# Altium schematic sheet Schematic.SchDoc
size A3; SheetNumber: 1; SheetTotal: 1
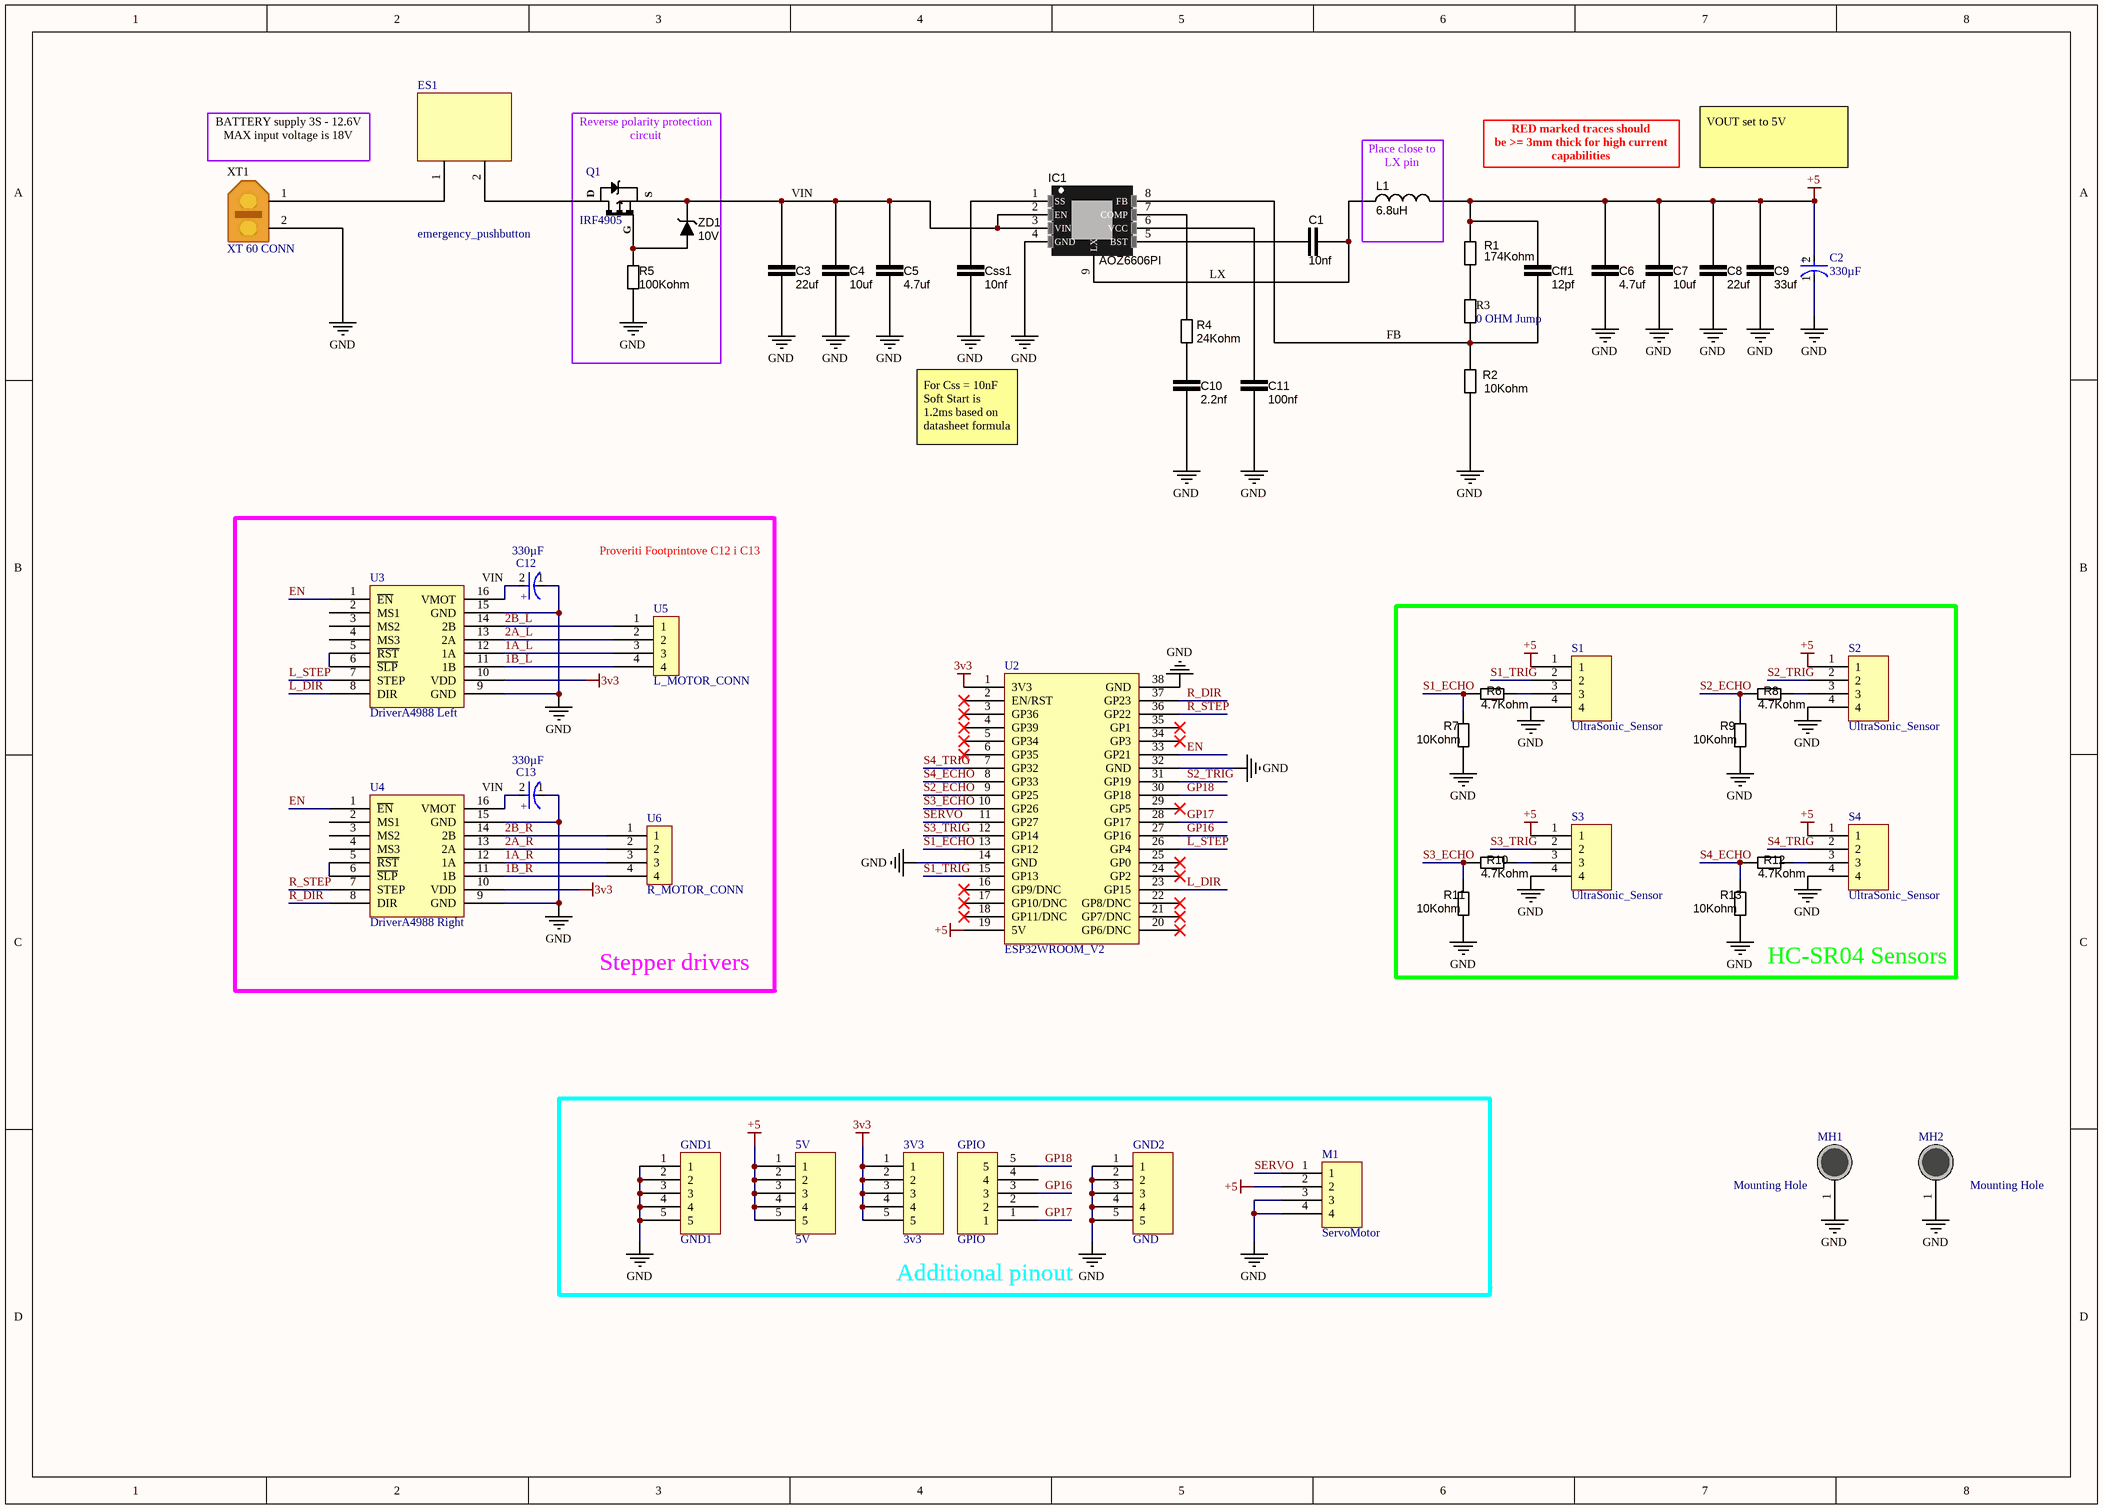
[diagram p0: Schematic.SchDoc]

## Parts
3V3  3v3  [PIN_HEADER5]
5V  5V  [PIN_HEADER5]
C1  10nf  [CAP_0603]
C2  330µF  [FP-FCG-MFG]
C3  22uf  [CAP_0805]
C4  10uf  [CAP_0805]
C5  4.7uf  [CAP_0805]
C6  4.7uf  [CAP_0805]
C7  10uf  [CAP_0805]
C8  22uf  [CAP_0805]
C9  33uf  [CAP_1206]
C10  2.2nf  [CAP_0603]
C11  100nf  [CAP_0603]
C12  330µF  [FP-FCG-MFG]
C13  330µF  [FP-FCG-MFG]
Cff1  12pf  [CAP_0603]
Css1  10nf  [CAP_0603]
ES1  emergency_pushbutton  [emergency_footprint]
GND1  GND1  [PIN_HEADER5]
GND2  GND  [PIN_HEADER5]
GPIO  GPIO  [PIN_HEADER5]
IC1  AOZ6606PI  [SOP127P600X170_HS-9N]
L1  6.8uH  [INDM108103X40N]
M1  ServoMotor  [UltraSonic_Sensor]
MH1  Mounting Hole  [HOLE-3mm]
MH2  Mounting Hole  [HOLE-3mm]
Q1  IRF4905  [DPAK254P1524X483-3N]
R1  174Kohm  [RES_0603]
R2  10Kohm  [RES_0603]
R3  0 OHM Jump  [RES_0603]
R4  24Kohm  [RES_0603]
R5  100Kohm  [RES_0603]
R6  4.7Kohm  [RES_0603]
R7  10Kohm  [RES_0603]
R8  4.7Kohm  [RES_0603]
R9  10Kohm  [RES_0603]
R10  4.7Kohm  [RES_0603]
R11  10Kohm  [RES_0603]
R12  4.7Kohm  [RES_0603]
R13  10Kohm  [RES_0603]
S1  UltraSonic_Sensor  [UltraSonic_Sensor]
S2  UltraSonic_Sensor  [UltraSonic_Sensor]
S3  UltraSonic_Sensor  [UltraSonic_Sensor]
S4  UltraSonic_Sensor  [UltraSonic_Sensor]
U2  ESP32WROOM_V2  [ESP32WROOM]
U3  DriverA4988 Left  [DriverA4988]
U4  DriverA4988 Right  [DriverA4988]
U5  L_MOTOR_CONN  [STEP_MOTOR_CONN]
U6  R_MOTOR_CONN  [STEP_MOTOR_CONN]
XT1  XT 60 CONN  [XT60_CONN]
ZD1  10V  [DIO_SMA]

## Blocks framed on the sheet
Stepper drivers: C12 C13 U3-U6
HC-SR04 Sensors: R6-R13 S1-S4
Additional pinout: 3V3 5V GND1 GND2 GPIO M1

## Nets
3v3: 3V3.1 3V3.2 3V3.3 3V3.4 3V3.5 U2.1(3V3) U3.10(VDD) U4.10(VDD)
+5: 5V.1 5V.2 5V.3 5V.4 5V.5 C2.2(A) C6.2 C7.2 C8.2 C9.2 Cff1.2 L1.2 M1.2 R1.2 S1.1 S2.1 S3.1 S4.1 U2.19(5V)
GND: C2.1(C) C3.1 C4.1 C5.1 C6.1 C7.1 C8.1 C9.1 C10.1 C11.1 C12.1(C) C13.1(C) Css1.1 GND1.1 GND1.2 GND1.3 GND1.4 GND1.5 GND2.1 GND2.2 GND2.3 GND2.4 GND2.5 IC1.4(GND) M1.3 M1.4 MH1.1 MH2.1 R2.1 R5.1 R7.2 R9.2 R11.2 R13.2 S1.4 S2.4 S3.4 S4.4 U2.14(GND) U2.32(GND) U2.38(GND) U3.9(GND) U3.15(GND) U4.9(GND) U4.15(GND) XT1.2
1A_L: U3.12(1A) U5.3
1A_R: U4.12(1A) U6.3
1B_L: U3.11(1B) U5.4
1B_R: U4.11(1B) U6.4
2A_L: U3.13(2A) U5.2
2A_R: U4.13(2A) U6.2
2B_L: U3.14(2B) U5.1
2B_R: U4.14(2B) U6.1
EN: U2.33(GP21) U3.1(~{EN}) U4.1(~{EN})
FB: Cff1.1 IC1.8(FB) R2.2 R3.1
GP16: GPIO.3 U2.27(GP16)
GP17: GPIO.1 U2.28(GP17)
GP18: GPIO.5 U2.30(GP18)
L_DIR: U2.23(GP15) U3.8(DIR)
L_STEP: U2.26(GP4) U3.7(STEP)
LX: C1.2 IC1.9(LX) L1.1
R_DIR: U2.37(GP23) U4.8(DIR)
R_STEP: U2.36(GP22) U4.7(STEP)
S1_ECHO: R6.1 R7.1 U2.13(GP12)
S1_TRIG: S1.2 U2.15(GP13)
S2_ECHO: R8.1 R9.1 U2.9(GP25)
S2_TRIG: S2.2 U2.31(GP19)
S3_ECHO: R10.1 R11.1 U2.10(GP26)
S3_TRIG: S3.2 U2.12(GP14)
S4_ECHO: R12.1 R13.1 U2.8(GP33)
S4_TRIG: S4.2 U2.7(GP32)
SERVO: M1.1 U2.11(GP27)
VIN: C3.2 C4.2 C5.2 C12.2(A) C13.2(A) IC1.2(EN) IC1.3(VIN) Q1.3 U3.16(VMOT) U4.16(VMOT) ZD1.1(Cathode)
NetC1_1: C1.1 IC1.5(BST)
NetC10_2: C10.2 R4.1
NetC11_2: C11.2 IC1.6(VCC)
NetCss1_2: Css1.2 IC1.1(SS)
NetES1_1: ES1.1 XT1.1
NetES1_2: ES1.2 Q1.4
NetIC1_7: IC1.7(COMP) R4.2
NetQ1_1: Q1.1(G) R5.2 ZD1.2(Anode)
NetR1_1: R1.1 R3.2
NetR6_2: R6.2 S1.3
NetR8_2: R8.2 S2.3
NetR10_2: R10.2 S3.3
NetR12_2: R12.2 S4.3
NetU3_5: U3.5(~{RST}) U3.6(~{SLP})
NetU4_5: U4.5(~{RST}) U4.6(~{SLP})

Not connected (* = marked no-connect by the designer): GPIO 2 4; U2 2(EN/RST)* 3(GP36)* 4(GP39)* 5(GP34)* 6(GP35)* 16(GP9/DNC)* 17(GP10/DNC)* 18(GP11/DNC)* 20(GP6/DNC)* 21(GP7/DNC)* 22(GP8/DNC)* 24(GP2)* 25(GP0)* 29(GP5)* 34(GP3)* 35(GP1)*; U3 2(MS1) 3(MS2) 4(MS3); U4 2(MS1) 3(MS2) 4(MS3)

## Notes on the sheet
- (near XT1) BATTERY supply 3S - 12.6V                                 MAX input voltage is 18V
- RED marked traces should                       be >= 3mm thick for high current capabilities
- VOUT set to 5V
- (near L1) Place close to LX pin
- Reverse polarity protection circuit
- For Css = 10nF Soft Start is 1.2ms based on datasheet formula
- Proveriti Footprintove C12 i C13
- (in symbol CMP-00287-05412923-1) +
- (in symbol IRF4905) D; S

## Library data of the parts
3V3 GND2 GPIO = PIN_HEADER5: 5 pin header 100 mil
5V GND1 = PIN_HEADER5: 5 pin header 100 mils
C1 Css1 = 0000005: CAP CER 10nF 0603 25V X7R; capaticanse: 10nf; ComponentLink1Description: digikey; ComponentLink1URL: https://www.digikey.com/en/products/detail/kyocera-avx/06033C103MAT2A/1599370
C2 C12 C13 = CMP-00287-05412923-1: EEEFC1V331AP 330 uF, Aluminum Electrolytic Capacitor, 35 V, Radial Can - SMD; Impedance: 150mΩ; Dielectric Material: Aluminium; Voltage: 35V; Ripple Current: 670mA; Lead Length: 3.5mm; Dissipation Factor: 12%; Leakage Current: 3µA; Life (Hours): 1000hours; Tolerance: 20%; Min Operating Temperature: -40°C; Height - Seated (Max): 10.2108mm; Lead Pitch: 4.6mm; NexarPartId: 5412923; Case/Package: Radial; ESR (Equivalent Series Resistance): 150mΩ; Voltage Rating (DC): 35V; REACH SVHC: No SVHC; Width: 10.3mm; Lifecycle Status: Production; RoHS: Compliant; Height: 10.2mm; Contact Plating: Tin; Voltage Rating: 35V; Capacitance: 330µF; Lead Free: Lead Free; Number of Pins: 2; Voltage Rating (AC): 35V; Schedule B: 8532220020, 8532220020; Max Operating Temperature: 105°C; Diameter: 10mm; Mount: PCB, Surface Mount; Termination: SMD/SMT; Length: 10.5mm; Packaging: Cut Tape; Ripple Current (AC): 670mA; Features: General Purpose; Radiation Hardening: No
C3 C8 = 0000001: CAP CER 22uF 0805 25V X5R; capaticanse: 22uf; ComponentLink1Description: digikey; ComponentLink1URL: https://www.digikey.com/en/products/detail/tdk-corporation/C2012X5R1E226M125AC/3661564
C4 C7 = 0000002: CAP CER 10uF 0805 25V X5R; capaticanse: 10uf; ComponentLink1Description: digikey; ComponentLink1URL: https://www.digikey.com/en/products/detail/tdk-corporation/C2012X5R1E106K125AB/2443462
C5 C6 = 0000003: CAP CER 4.7uF 0805 25V X5R; capaticanse: 4.7uf; ComponentLink1Description: digikey; ComponentLink1URL: https://www.digikey.com/en/products/detail/kemet/C0805C475K3PAC7800/1950665
C9 = 0000004: CAP CER 33uF 1206 25V X5R; capaticanse: 33uf; ComponentLink1Description: digikey; ComponentLink1URL: https://www.digikey.com/en/products/detail/tdk-corporation/C3216X5R1E336M160AC/2792259
C10 = 0000006: CAP CER 2.2nF 0603 25V X7R; capaticanse: 2.2nf; ComponentLink1Description: digikey; ComponentLink1URL: https://www.digikey.com/en/products/detail/yageo/CC0603KRX7R8BB222/2345066
C11 = 0000007: CAP CER 100nF 0603 25V X7R; capaticanse: 100nf; ComponentLink1Description: digikey; ComponentLink1URL: https://www.digikey.com/en/products/detail/kyocera-avx/06033C104K4T2A/8019250
Cff1 = 0000008: CAP CER 12pF 0603 25V X7R; capaticanse: 12pf; ComponentLink1Description: digikey; ComponentLink1URL: https://www.digikey.com/en/products/detail/kemet/C0603C120J3GACAUTO/11675595
IC1 = AOZ6606PI: Buck AOZ6606PI; partName: AOZ6606PI
L1 = L000002: IND 6.8uH 8A 23.3mOHM 13.5A ISAT; inductanse: 6.8uH; ComponentLink1Description: digikey; ComponentLink1URL: https://www.digikey.com/en/products/detail/vishay-dale/IHLP4040DZER6R8M01/1220696
M1 = UltraSonic_Sensor: 5 pin header 100 mil
MH1 MH2 = 00000006: Mounting Hole 3mm
Q1 = IRF4905: Manufacturer: International Rectifier; Manufacturer Part Number: IRF1404ZSPBF; Continuous Drain Current (ID): 75A; Current Rating: 49A; Drain to Source Breakdown Voltage: 40V; Drain to Source Resistance: 4mR; Drain-source On Resistance-Max: 3.7MR; Dual Supply Voltage: 55V; Element Configuration: Single; Fall Time: 58ns; Gate to Source Voltage (Vgs): 20V; Input Capacitance: 4.34nF; Max Power Dissipation: 200W; Nominal Vgs: 4V; Number of Elements: 1; Polarity: N-CHANNEL; Power Dissipation: 220W; Recovery Time: 42ns; Rise Time: 110ns; Turn-Off Delay Time: 36ns; Turn-On Delay Time: 18ns; Case/Package: D2PAK; Category: MOSFETs; Drain to Source Voltage (Vdss): 40V; Height: 4.83mm; Lead Free: Lead Free; Length: 10.67mm; Max Operating Temperature: 175°C; Min Operating Temperature: -55°C; Mount: Surface Mount; Number of Pins: 3; Package Quantity: 50; Packaging: Rail/Tube; Radiation Hardening: No; Rds On Max: 3.7mR; REACH SVHC: No SVHC; RoHS Compliant: Yes; Series: HEXFET®; Termination: SMD/SMT; Voltage Rating (DC): 55V; Width: 9.65mm; On-State Resistance: 3.7MR; Threshold Voltage: 4V
R1 = R000003: RES 174k OHM 0603 1/10W; resistance: 174Kohm; ComponentLink1Description: digikey; ComponentLink1URL: https://www.digikey.com/en/products/detail/stackpole-electronics-inc/RMCF0603FT174K/1761066
R2 R7 R9 R11 R13 = R000001: RES 10k OHM 0603 1/10W; resistance: 10Kohm; ComponentLink1Description: digikey; ComponentLink1URL: https://www.digikey.com/en/products/detail/vishay-beyschlag-draloric-bc-components/MCT06030C1002FP500/1850440
R3 = R000007: RES 0 OHM JUMPER 1/10W 0603; Supplier 1: Arrow Electronics; Supplier Part Number 1: RMCF0603ZT0R00; ComponentLink1Description: DigiKey; ComponentLink1URL: https://www.digikey.com/en/products/detail/stackpole-electronics-inc/RMCF0603ZT0R00/1756908; resistance: 0 OHM Jump
R4 = R000005: RES 24k OHM 0603 1/10W; resistance: 24Kohm; ComponentLink1Description: digikey; ComponentLink1URL: https://www.digikey.com/en/products/detail/stackpole-electronics-inc/RMCF0603FG24K0/1713826
R5 = R000006: RES 100k OHM 0603 1/10W; resistance: 100Kohm; ComponentLink1Description: digikey; ComponentLink1URL: https://www.digikey.com/en/products/detail/stackpole-electronics-inc/RMCF0603FG100K/1713543
R6 R8 R10 R12 = R000001: RES 4k7 OHM 0603 1/10W; resistance: 10Kohm; ComponentLink1Description: digikey; ComponentLink1URL: https://www.digikey.com/en/products/detail/vishay-beyschlag-draloric-bc-components/MCT06030C1002FP500/1850440
S1-S4 = UltraSonic_Sensor: Connector onaj beli
U2 = ESP32WROOM_V2: Pinout Acine ESP32 Wroom plocice, pinovi poslagani po redu
U3 U4 = DriverA4988: Stepp Motor Driver
U5 U6 = STEP_MOTOR_CONN: Connector onaj beli
XT1 = XT60 CONN
ZD1 = 1SMA5931-AU_R1: Zener Diode 10 V 5 W ±5% Surface Mount SMC (DO-214AB); Value: 10V; ComponentLink1Description: digikey; ComponentLink1URL: https://www.digikey.com/en/products/detail/panjit-international-inc/1SMC5347-AU-R1-000A1/15799564